# EAGLE design STK505clone (EAGLE 5.01)
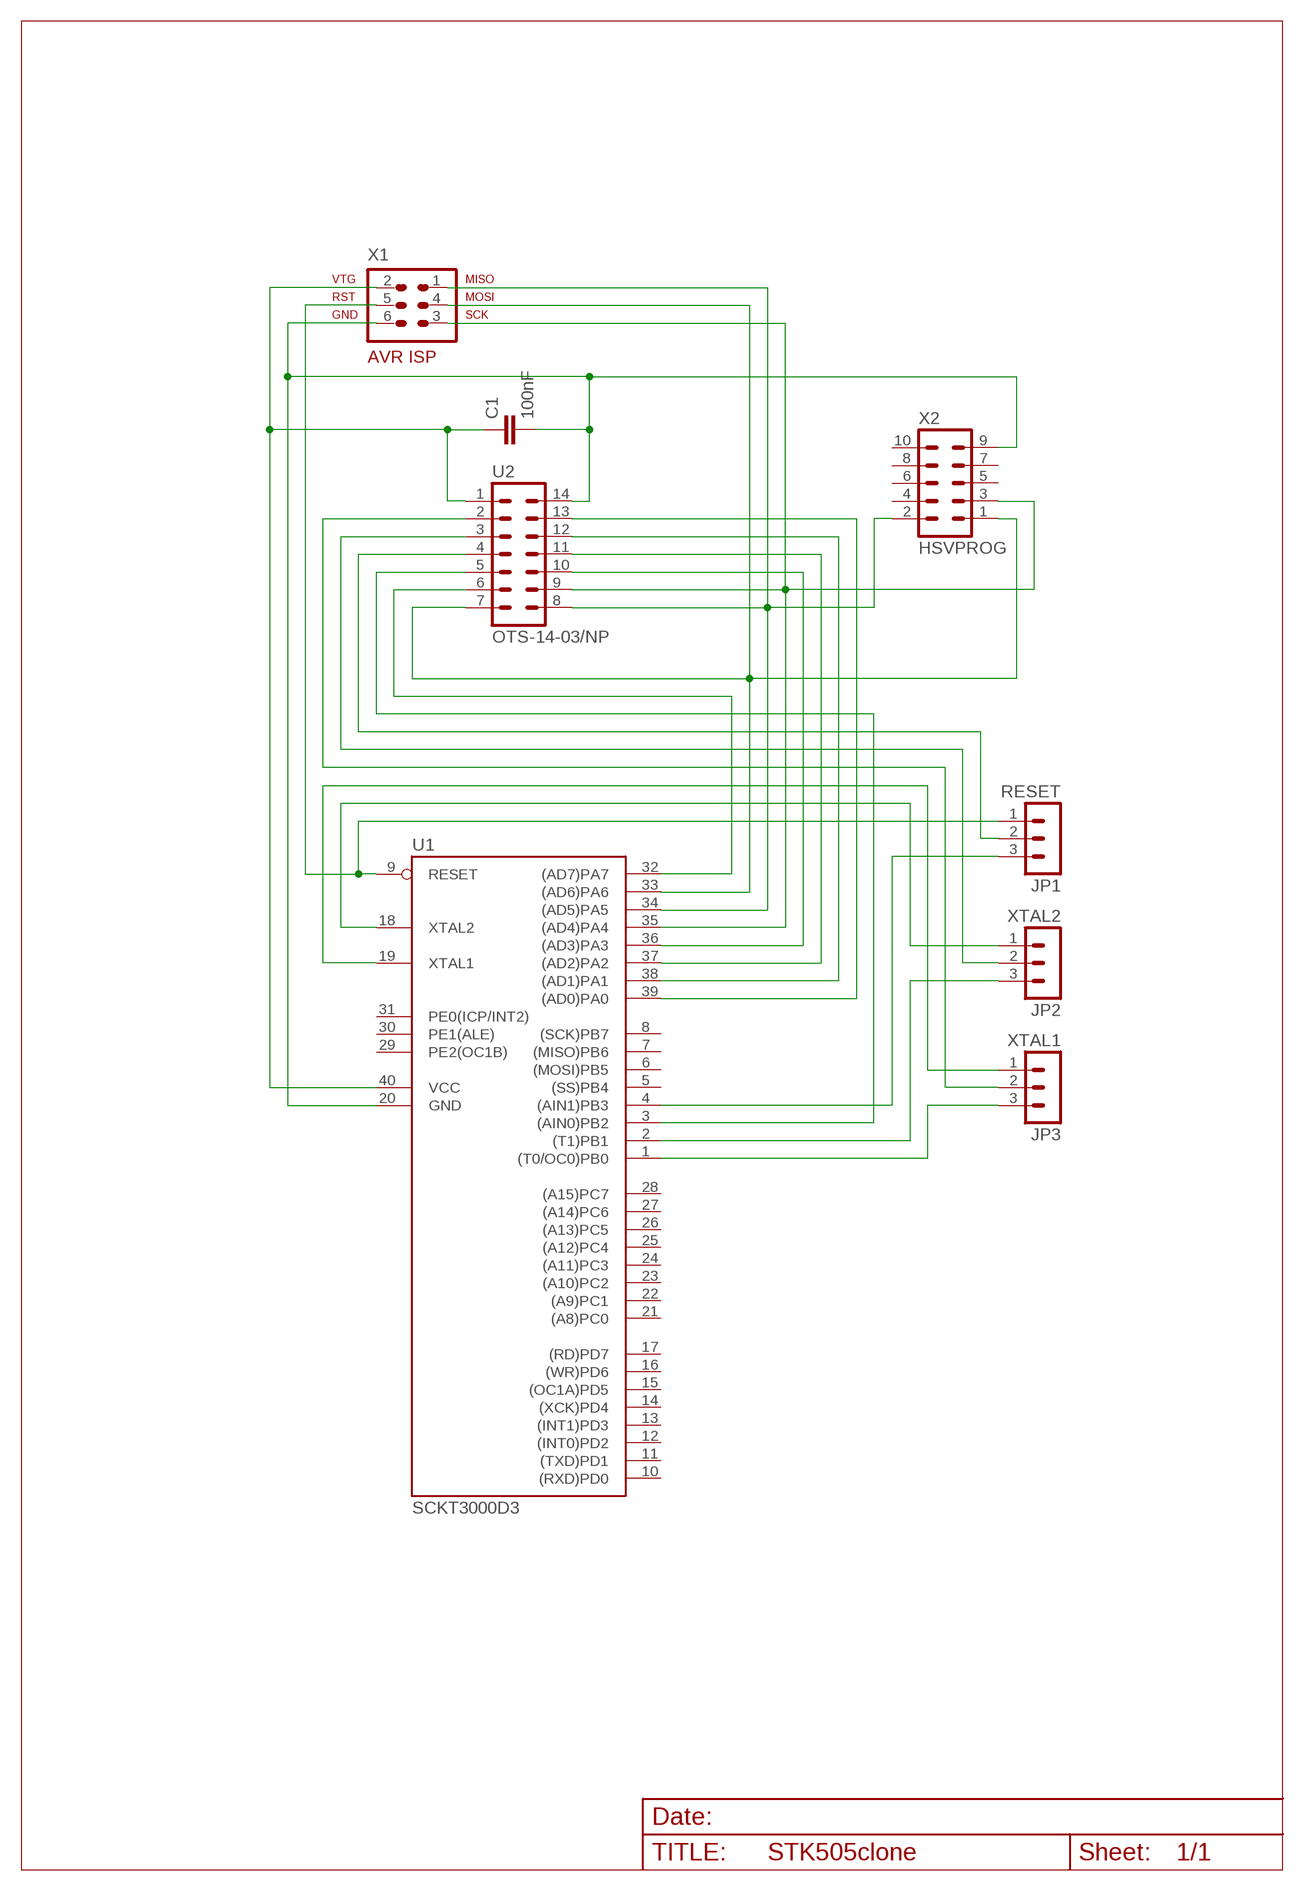
[diagram p0: schematic, sheet 1]

## Parts
C1  100nF  C-EU050-024X044  [C050-024X044]
JP1  RESET  MA3-1  [MA3-1]
JP2  XTAL2  MA3-1  [MA3-1]
JP3  XTAL1  MA3-1  [MA3-1]
U1  SCKT3000D3  MEGA8515-P  [DIL40]
U2  OTS-14-03/NP  [OTS-14-03/NP]
X1  AVR-ISP-6  [AVR-ISP-6]
X2  HSVPROG  MA05-2  [MA05-2]

## Nets
GND: C1.2 U1.20(GND) U2.14 X1.6 X2.9
PA0: U1.39((AD0)PA0) U2.13
PA1: U1.38((AD1)PA1) U2.12
PA2: U1.37((AD2)PA2) U2.11
PA3: U1.36((AD3)PA3) U2.10
PA4: U1.35((AD4)PA4) U2.9 X1.3 X2.3
PA5: U1.34((AD5)PA5) U2.8 X1.1 X2.2
PA6: U1.33((AD6)PA6) U2.7 X1.4 X2.1
PA7: U1.32((AD7)PA7) U2.6
PB0: JP3.3 U1.1((T0/OC0)PB0)
PB1: JP2.3 U1.2((T1)PB1)
PB2: U1.3((AIN0)PB2) U2.5
PB3: JP1.3 U1.4((AIN1)PB3)
PBX0: JP3.2 U2.2
PBX1: JP2.2 U2.3
PBX3: JP1.2 U2.4
RESET: JP1.1 U1.9(RESET) X1.5
VCC: C1.1 U1.40(VCC) U2.1 X1.2
XTAL1: JP3.1 U1.19(XTAL1)
XTAL2: JP2.1 U1.18(XTAL2)
Unconnected: U1.5((SS)PB4) U1.6((MOSI)PB5) U1.7((MISO)PB6) U1.8((SCK)PB7) U1.10((RXD)PD0) U1.11((TXD)PD1) U1.12((INT0)PD2) U1.13((INT1)PD3) U1.14((XCK)PD4) U1.15((OC1A)PD5) U1.16((WR)PD6) U1.17((RD)PD7) U1.21((A8)PC0) U1.22((A9)PC1) U1.23((A10)PC2) U1.24((A11)PC3) U1.25((A12)PC4) U1.26((A13)PC5) U1.27((A14)PC6) U1.28((A15)PC7) U1.29(PE2(OC1B)) U1.30(PE1(ALE)) U1.31(PE0(ICP/INT2)) X2.4 X2.5 X2.6 X2.7 X2.8 X2.10

## Library data of the parts
C1 = rcl:C-EU: CAPACITOR, European symbol
JP1-JP3 = connector:MA3-1: Pin Header with round pads
U1 = avr-4:MEGA8515-P: MICROCONTROLLER 8 Kbytes FLASH 512 bytes SRAM 512 bytes EEPROM USART 8-channel 10 bit ADC
U2 = zif_socket:OTS-14-03: Enplas 14-SOIC Open Top ZIF Socket
X1 = avr-4:AVR-ISP-6: AVR ISP-6 Serial Programming Header
X2 = con-lstb:MA05-2: PIN HEADER

## Board
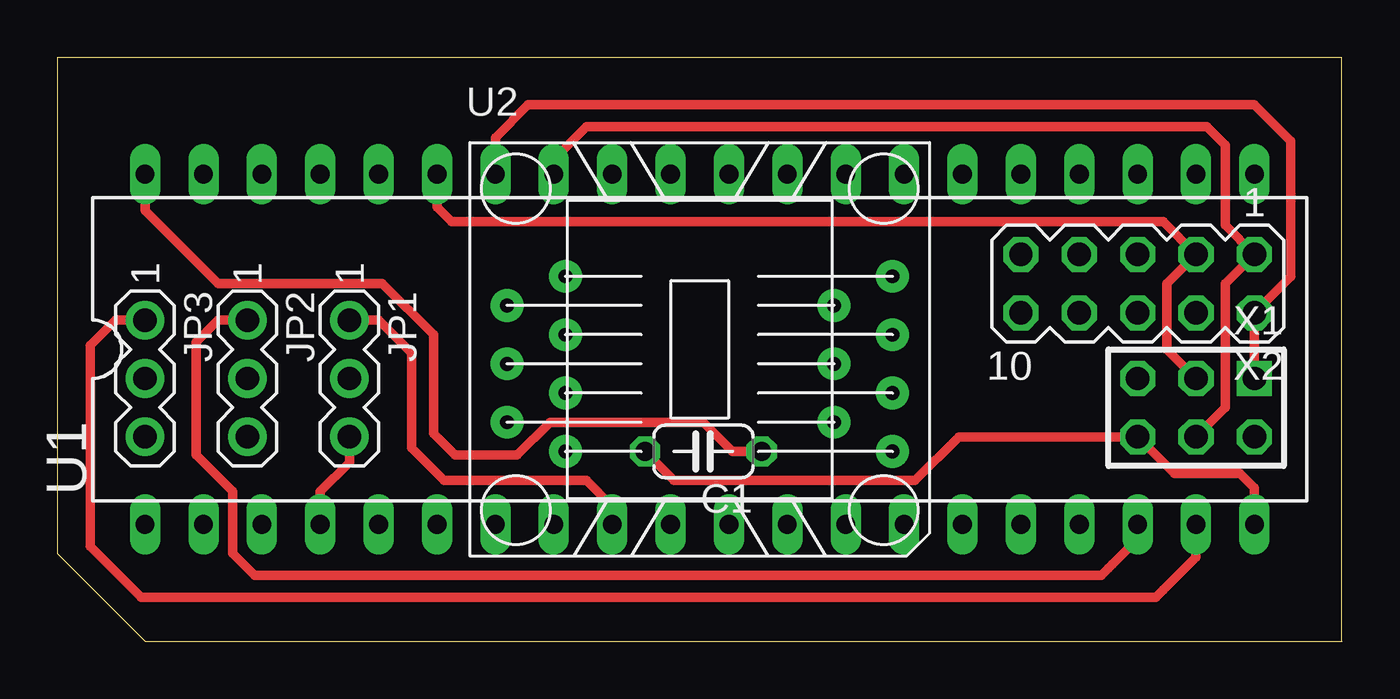
[diagram p1: board, top side]
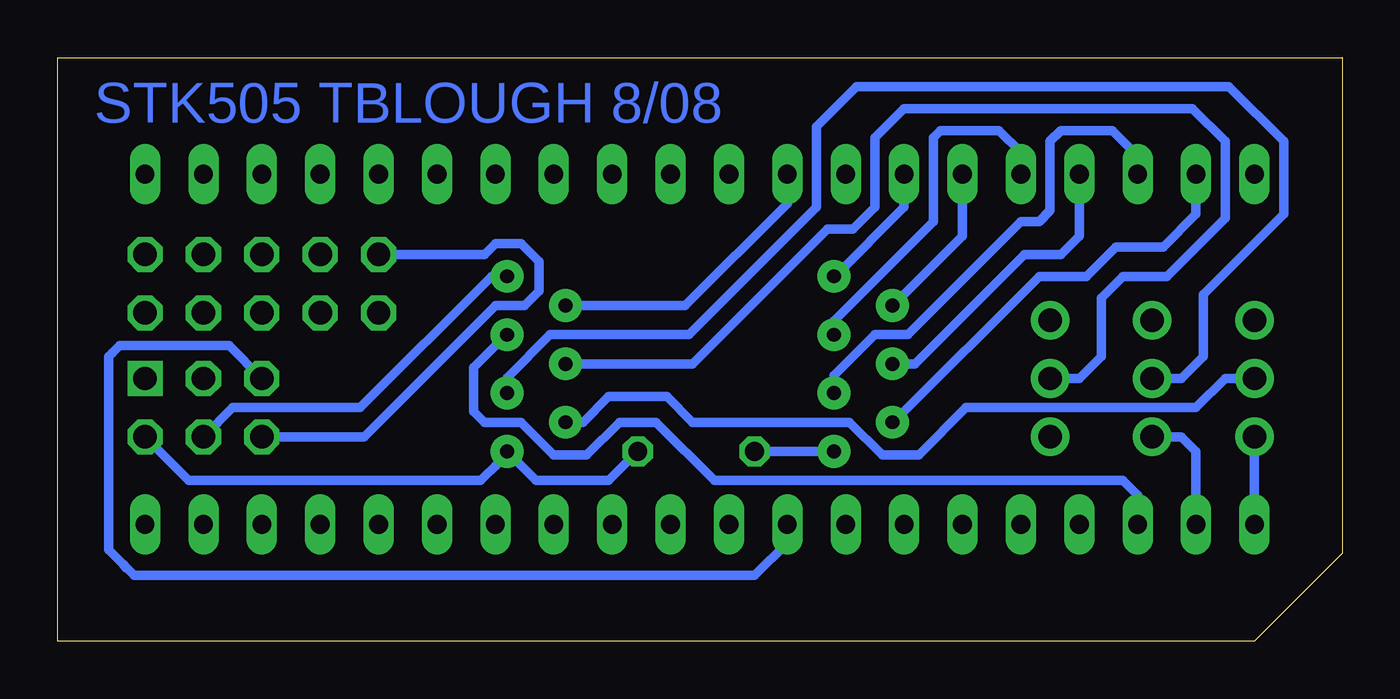
[diagram p2: board, bottom side, seen from below]

Size 55.88 x 25.4 mm. Coordinates in mm from the lower left corner, seen from the top.
Outline: 55.87,0.01 55.87,25.39 0.01,25.39
Outline: 0,25.4 0,3.81 3.81,0 55.88,0
Copper layers (1*16): Top 0.035mm / dielectric 1.5mm / Bottom 0.035mm
Design rules "default": minimum track width 10mil, minimum drill 24mil, track to track 8mil, track to pad 8mil, pad to pad 8mil, via to via 8mil, smd to smd 8mil, copper to edge 40mil, drill to drill 8mil, minimum pad ring 10mil, minimum via ring 8mil, stop-mask expansion 4mil, vias tented up to drill 0mil, thermal gap 10mil

### Footprints (pad centres in the part's own frame; a part is rotated, then mirrored left to right if it is on the bottom)
C050-024X044 = drill 0.813 octagon: 1 -2.54,0; 2 2.54,0
MA3-1 = drill 1.016 pad 1.676 round: 1 -2.54,0; 2 0,0; 3 2.54,0
DIL40 = drill 0.813 long: 1 -24.13,-7.62; 2 -21.59,-7.62; 3 -19.05,-7.62; 4 -16.51,-7.62; 5 -13.97,-7.62; 6 -11.43,-7.62; 7 -8.89,-7.62; 8 -6.35,-7.62; 9 -3.81,-7.62; 10 -1.27,-7.62; 11 1.27,-7.62; 12 3.81,-7.62; 13 6.35,-7.62; 14 8.89,-7.62; 15 11.43,-7.62; 16 13.97,-7.62; 17 16.51,-7.62; 18 19.05,-7.62; 19 21.59,-7.62; 20 24.13,-7.62; 21 24.13,7.62; 22 21.59,7.62; 23 19.05,7.62; 24 16.51,7.62; 25 13.97,7.62; 26 11.43,7.62; 27 8.89,7.62; 28 6.35,7.62; 29 3.81,7.62; 30 1.27,7.62; 31 -1.27,7.62; 32 -3.81,7.62; 33 -6.35,7.62; 34 -8.89,7.62; 35 -11.43,7.62; 36 -13.97,7.62; 37 -16.51,7.62; 38 -19.05,7.62; 39 -21.59,7.62; 40 -24.13,7.62
OTS-14-03/NP = drill 0.6 pad 1.422 round: 1 8.382,-4.445; 2 5.842,-3.175; 3 8.382,-1.905; 4 5.842,-0.635; 5 8.382,0.635; 6 5.842,1.905; 7 8.382,3.175; 8 -5.842,3.175; 9 -8.382,1.905; 10 -5.842,0.635; 11 -8.382,-0.635; 12 -5.842,-1.905; 13 -8.382,-3.175; 14 -5.842,-4.445
AVR-ISP-6 = drill 1.016 square: 1 -2.54,-1.27 | drill 1.016 octagon: 2 -2.54,1.27; 3 0,-1.27; 4 0,1.27; 5 2.54,-1.27; 6 2.54,1.27
MA05-2 = drill 1.016 octagon: 1 -5.08,-1.27; 2 -5.08,1.27; 3 -2.54,-1.27; 4 -2.54,1.27; 5 0,-1.27; 6 0,1.27; 7 2.54,-1.27; 8 2.54,1.27; 9 5.08,-1.27; 10 5.08,1.27

### Placement (x,y rotation side)
C1  28.1,8.26 180 top
JP1  12.7,11.43 270 top
JP2  8.26,11.43 270 top
JP3  3.81,11.43 270 top
U1  27.94,12.7 0 top
U2  27.94,12.7 0 top
X1  49.53,10.16 180 top
X2  46.99,15.56 180 top

### Tracks (layer width: path | path; a pad name or v marks a point on that pad's centre or on a via)
GND
  Top 0.406: C1.2 26.83,6.99 37.31,6.99 39.21,8.89 X1.6 48.58,7.3 51.44,7.3 52.07,6.67 U1.20
  Bottom 0.406: U2.14 C1.2 | X1.6 42.55,8.89 36.83,14.61 35.56,14.61 34.93,15.24 34.93,16.51 35.72,17.3 36.83,17.3 37.31,16.83 X2.9
PA0
  Bottom 0.406: U2.13 19.53,9.53 13.18,15.88 11.11,15.88 9.84,17.14 7.78,17.14 6.35,18.57 U1.39 6.35,19.68
PA1
  Bottom 0.406: U2.12 22.1,11.56 20.32,13.34 18.89,13.34 13.97,18.26 13.18,18.26 12.7,18.73 12.7,21.75 12.22,22.23 10,22.23 8.89,21.11 U1.38
PA2
  Bottom 0.406: 11.43,20.48 U1.37 11.43,19.84 | 11.43,19.84 11.43,19.68 | 11.43,19.84 11.43,17.62 12.22,16.83 13.81,16.83 18.57,12.06 U2.11
PA3
  Bottom 0.406: U2.10 22.1,13.94 17.78,18.26 17.78,21.91 17.46,22.23 14.92,22.23 13.97,21.27 U1.36
PA4
  Top 0.406: X2.3 48.26,15.56 48.26,12.7 49.37,11.59 49.69,11.59 X1.3 | X2.3 | X2.3 48.1,18.26 17.14,18.26 16.51,18.89 U1.35 16.51,20.48
  Bottom 0.406: U2.9 19.53,14.61 16.51,17.62 U1.35
PA5
  Top 0.406: X1.1 X2.2 53.66,15.88 53.66,21.75 52.07,23.34 20.48,23.34 19.05,21.91 U1.34
  Bottom 0.406: U2.8 22.07,15.88 19.05,18.89 U1.34
PA6
  Top 0.406: X1.4 50.8,10.16 50.8,15.56 X2.1 50.8,18.1 50.8,21.59 50.01,22.38 23.02,22.38 21.59,20.95 U1.33
  Bottom 0.406: 36.35,15.88 U2.7 36.99,15.88 42.7,10.16 48.26,10.16 X1.4
PA7
  Bottom 0.406: U2.6 28.57,14.61 24.13,19.05 U1.32
PB0
  Bottom 0.406: U1.1 JP3.3
PB1
  Bottom 0.406: 7.62,8.89 JP2.3 | U1.2 6.35,8.26 6.99,8.89 7.62,8.89 | 7.62,8.89
PB2
  Bottom 0.406: U1.3 8.89,6.35 9.52,6.99 27.3,6.99 29.84,9.53 31.43,9.53 32.86,8.1 34.29,8.1 35.72,9.53 37.31,9.53 37.78,10 37.78,11.91 36.35,13.34 U2.5 36.2,13.34
PB3
  Top 0.406: U1.4 11.43,6.51 12.7,7.78 JP1.3 | JP1.3
PBX0
  Bottom 0.406: U2.2 33.02,9.53 31.91,10.64 29.37,10.64 28.26,9.53 21.43,9.53 20,8.1 18.41,8.1 16.35,10.16 6.35,10.16 5.08,11.43 JP3.2
PBX1
  Bottom 0.406: U2.3 36.32,11.46 34.45,13.34 28.42,13.34 22.86,18.89 22.86,22.38 21.11,24.13 4.92,24.13 2.54,21.75 2.54,18.57 6.03,15.08 6.03,12.38 6.99,11.43 JP2.2 | JP2.2
PBX3
  Bottom 0.406: U2.4 28.26,12.06 22.38,17.94 21.27,17.94 20.32,18.89 20.32,21.91 19.05,23.18 6.51,23.18 5.08,21.75 5.08,18.41 7.62,15.88 9.52,15.88 10.48,14.92 10.48,12.38 11.43,11.43 | 11.91,11.43 JP1.2 | 11.91,11.43 | 11.59,11.43 | 11.59,11.43 11.91,11.43 | 11.43,11.43 | 11.43,11.43 11.59,11.43
RESET
  Top 0.406: U1.9 24.13,5.87 23.02,6.99 16.83,6.99 15.4,8.41 15.4,12.54 13.97,13.97 JP1.1
  Bottom 0.406: 53.02,3.33 52.86,3.17 | U1.9 24.13,4.29 25.56,2.86 52.55,2.86 53.02,3.33 | 53.5,12.54 53.18,12.86 48.42,12.86 X1.5 | 53.02,3.33 53.66,3.97 53.66,12.38 53.5,12.54 | 53.5,12.54
VCC
  Top 0.406: C1.1 29.37,8.26 28.1,9.53 21.43,9.53 20,8.1 17.3,8.1 16.35,9.05 16.35,13.34 14.13,15.56 6.99,15.56 3.81,18.73 U1.40
  Bottom 0.406: 36.67,7.78 36.2,8.26 U2.1 35.05,6.99 31.91,6.99 C1.1 | 36.67,7.78 36.83,7.62 | X1.2 50.16,6.99 37.47,6.99 36.67,7.78 | 36.67,7.78
XTAL1
  Top 0.406: 48.1,2.22 49.53,3.65 49.53,4.92 49.69,5.08 U1.19 | 48.1,2.22 | 48.1,2.22 47.78,1.91 3.65,1.91 1.43,4.13 1.43,12.86 2.54,13.97 JP3.1
XTAL2
  Top 0.406: 45.88,3.33 46.99,4.45 U1.18 | 45.88,3.33 45.72,3.17 | 7.46,13.97 | 7.46,13.97 JP2.1 | 7.46,13.97 | 45.88,3.33 45.4,2.86 8.57,2.86 7.62,3.81 7.62,6.51 6.03,8.1 6.03,13.02 6.99,13.97 7.46,13.97

### Text on the board
Bottom: STK505 TBLOUGH 8/08
Document: SEE STK505 DOCUMENTATION | HVSP | 1 | X | 2 | X | R | 1 | 2 | PBx | ISP | 1 | 2 | ATTINY24/44/84 | SCKT3000D3